# Altium schematic sheet SIM868.SchDoc: Sim868 Development Board
size A; SheetNumber: 2; SheetTotal: 14
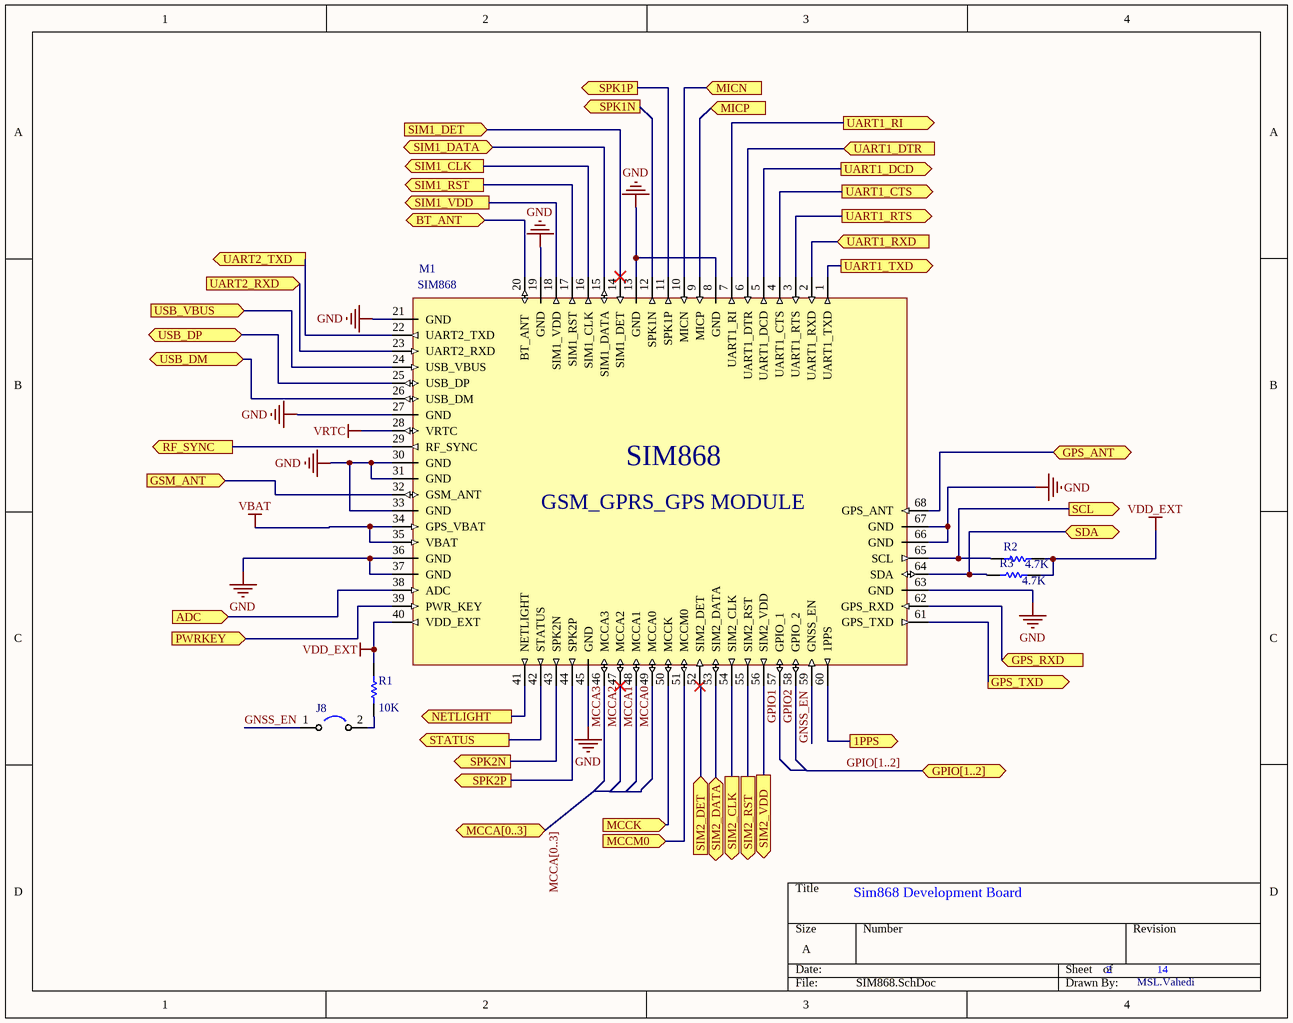
[diagram p0: SIM868.SchDoc]

## Parts
J8  (no value)  [JuMPER]
M1  SIM868  [SIM868]
R1  value 10K  [RES0805]
R2  value 4.7K  [RES0805]
R3  value 4.7K  [RES0805]

## Ports
1PPS (out), ADC (in), BT_ANT (bidir), GPIO[1..2] (bidir), GPS_ANT (bidir), GPS_RXD (in), GPS_TXD (out), GSM_ANT (in), MCCA[0..3] (bidir), MCCK (in), MCCM0 (in), MICN (in), MICP (in), NETLIGHT (out), PWRKEY (in), RF_SYNC (out), SCL (out), SDA (bidir), SIM1_CLK (out), SIM1_DATA (bidir), SIM1_DET (in), SIM1_RST (out), SIM1_VDD (out), SIM2_CLK (out), SIM2_DATA (bidir), SIM2_DET (in), SIM2_RST (out), SIM2_VDD (out), SPK1N (out), SPK1P (out), SPK2N (out), SPK2P (out), STATUS (out), UART1_CTS (out), UART1_DCD (out), UART1_DTR (in), UART1_RI (out), UART1_RTS (out), UART1_RXD (in), UART1_TXD (out), UART2_RXD (in), UART2_TXD (out), USB_DM (bidir), USB_DP (bidir), USB_VBUS (in)

## Nets
GND: M1.8(GND) M1.13(GND) M1.19(GND) M1.21(GND) M1.27(GND) M1.30(GND) M1.31(GND) M1.33(GND) M1.36(GND) M1.37(GND) M1.45(GND) M1.63(GND) M1.66(GND) M1.67(GND)
VBAT: M1.34(GPS_VBAT) M1.35(VBAT)
VDD_EXT: M1.40(VDD_EXT) R1.2 R2.2 R3.2
VRTC: M1.28(VRTC)
1PPS: M1.60(1PPS) ; port 1PPS
ADC: M1.38(ADC) ; port ADC
BT_ANT: M1.20(BT_ANT) ; port BT_ANT
GNSS_EN: J8.1 M1.59(GNSS_EN)
GPIO1: M1.57(GPIO_1)
GPIO2: M1.58(GPIO_2)
GPS_ANT: M1.68(GPS_ANT) ; port GPS_ANT
GPS_RXD: M1.62(GPS_RXD) ; port GPS_RXD
GPS_TXD: M1.61(GPS_TXD) ; port GPS_TXD
GSM_ANT: M1.32(GSM_ANT) ; port GSM_ANT
MCCA0: M1.49(MCCA0)
MCCA1: M1.48(MCCA1)
MCCA2: M1.47(MCCA2)
MCCA3: M1.46(MCCA3)
MCCK: M1.50(MCCK) ; port MCCK
MCCM0: M1.51(MCCM0) ; port MCCM0
MICN: M1.10(MICN) ; port MICN
MICP: M1.9(MICP) ; port MICP
NETLIGHT: M1.41(NETLIGHT) ; port NETLIGHT
PWRKEY: M1.39(PWR_KEY) ; port PWRKEY
RF_SYNC: M1.29(RF_SYNC) ; port RF_SYNC
SCL: M1.65(SCL) R2.1 ; port SCL
SDA: M1.64(SDA) R3.1 ; port SDA
SIM1_CLK: M1.16(SIM1_CLK) ; port SIM1_CLK
SIM1_DATA: M1.15(SIM1_DATA) ; port SIM1_DATA
SIM1_DET: M1.14(SIM1_DET) ; port SIM1_DET
SIM1_RST: M1.17(SIM1_RST) ; port SIM1_RST
SIM1_VDD: M1.18(SIM1_VDD) ; port SIM1_VDD
SIM2_CLK: M1.54(SIM2_CLK) ; port SIM2_CLK
SIM2_DATA: M1.53(SIM2_DATA) ; port SIM2_DATA
SIM2_DET: M1.52(SIM2_DET) ; port SIM2_DET
SIM2_RST: M1.55(SIM2_RST) ; port SIM2_RST
SIM2_VDD: M1.56(SIM2_VDD) ; port SIM2_VDD
SPK1N: M1.12(SPK1N) ; port SPK1N
SPK1P: M1.11(SPK1P) ; port SPK1P
SPK2N: M1.43(SPK2N) ; port SPK2N
SPK2P: M1.44(SPK2P) ; port SPK2P
STATUS: M1.42(STATUS) ; port STATUS
UART1_CTS: M1.4(UART1_CTS) ; port UART1_CTS
UART1_DCD: M1.5(UART1_DCD) ; port UART1_DCD
UART1_DTR: M1.6(UART1_DTR) ; port UART1_DTR
UART1_RI: M1.7(UART1_RI) ; port UART1_RI
UART1_RTS: M1.3(UART1_RTS) ; port UART1_RTS
UART1_RXD: M1.2(UART1_RXD) ; port UART1_RXD
UART1_TXD: M1.1(UART1_TXD) ; port UART1_TXD
UART2_RXD: M1.23(UART2_RXD) ; port UART2_RXD
UART2_TXD: M1.22(UART2_TXD) ; port UART2_TXD
USB_DM: M1.26(USB_DM) ; port USB_DM
USB_DP: M1.25(USB_DP) ; port USB_DP
USB_VBUS: M1.24(USB_VBUS) ; port USB_VBUS
NetJ8_2: J8.2 R1.1

## Buses and harness runs
bus GPIO[1..2] = port GPIO[1..2]
bus MCCA[0..3] = port MCCA[0..3]

## Notes on the sheet
- MSL.Vahedi
- (in symbol SIM868) GSM_GPRS_GPS MODULE

## Library data of the parts
J8 = JUMPER
R1-R3 = Res1: Resistor; Published: 8-Jun-2000; LatestRevisionDate: 17-Jul-2002; LatestRevisionNote: Re-released for DXP Platform.; PackageReference: AXIAL-0.3; Publisher: Altium Limited; PackageDescription: Axial Device, Thru-Hole; 2 Leads; 0.3 in Pin Spacing